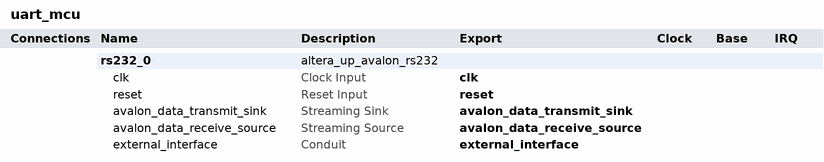
[diagram p0: system contents]
# Platform Designer (Qsys) system uart_mcu, MAX 10 10M08SAU169I7G
# Parameters at their usual value, and those the tool derives, are not listed.
package require -exact qsys 15.1
create_system uart_mcu
set_project_property DEVICE_FAMILY {MAX 10}
set_project_property DEVICE 10M08SAU169I7G

add_instance rs232_0 altera_up_avalon_rs232 15.1
set_instance_property rs232_0 AUTO_EXPORT true
set_instance_parameter_value rs232_0 avalon_bus_type Streaming
set_instance_parameter_value rs232_0 baud 9600
set_instance_parameter_value rs232_0 parity None

# exported interfaces
add_interface avalon_data_receive_source avalon_streaming source
set_interface_property avalon_data_receive_source EXPORT_OF rs232_0.avalon_data_receive_source
add_interface avalon_data_transmit_sink avalon_streaming sink
set_interface_property avalon_data_transmit_sink EXPORT_OF rs232_0.avalon_data_transmit_sink
add_interface clk clock sink
set_interface_property clk EXPORT_OF rs232_0.clk
add_interface external_interface conduit end
set_interface_property external_interface EXPORT_OF rs232_0.external_interface
add_interface reset reset sink
set_interface_property reset EXPORT_OF rs232_0.reset

set_interconnect_requirement {$system} qsys_mm.clockCrossingAdapter HANDSHAKE
set_interconnect_requirement {$system} qsys_mm.enableEccProtection FALSE
set_interconnect_requirement {$system} qsys_mm.insertDefaultSlave FALSE
set_interconnect_requirement {$system} qsys_mm.maxAdditionalLatency 1

save_system uart_mcu.qsys
